# Altium schematic sheet TemperatureController.SchDoc: Fermentor Temperature Controller
size A; Engineer: James L. Haynes
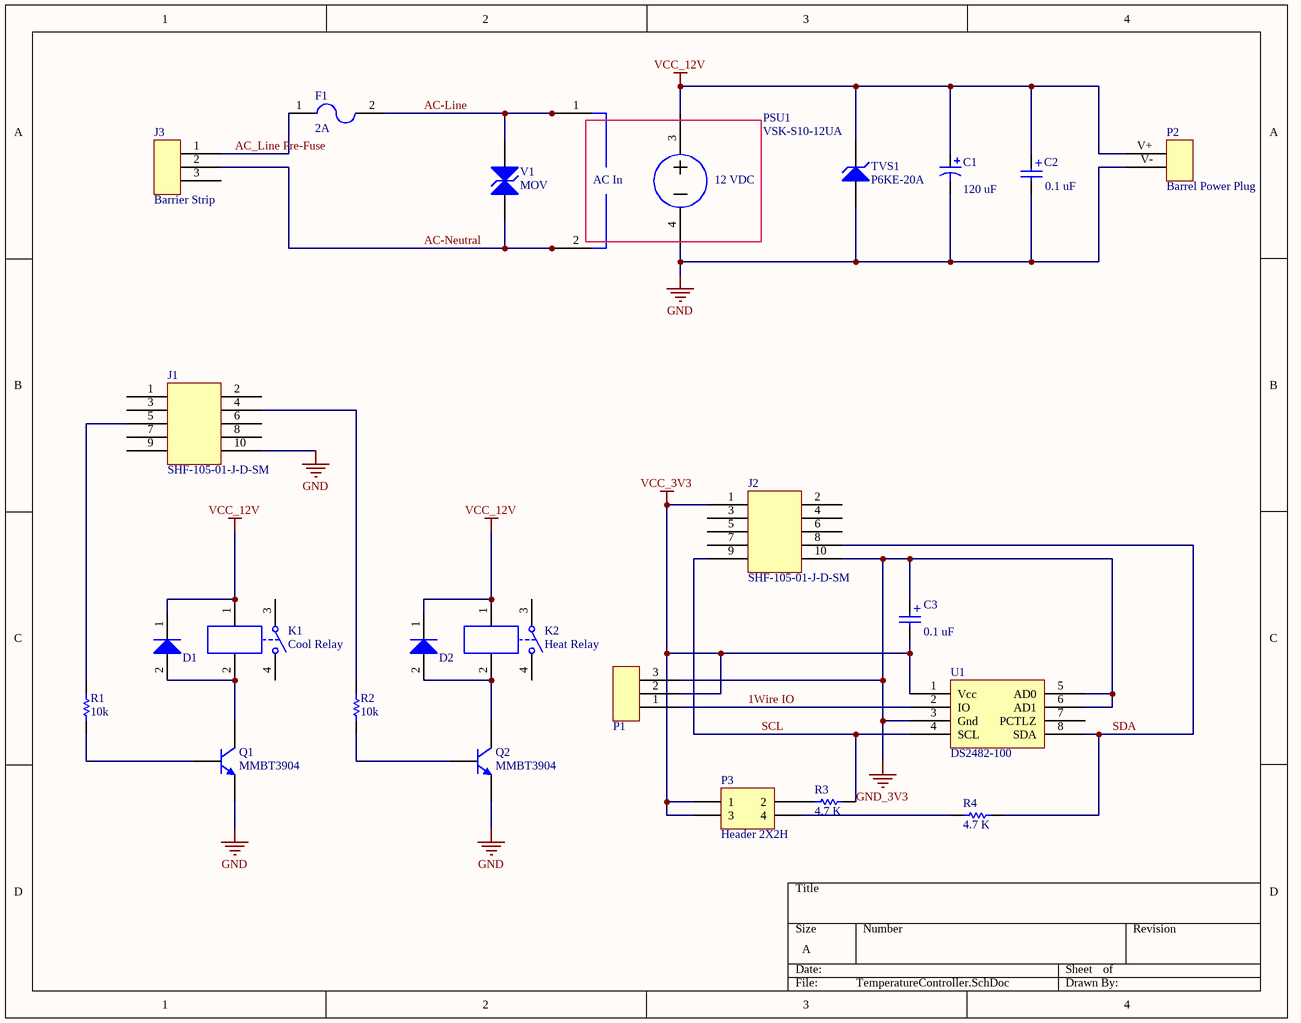
[diagram p0: TemperatureController.SchDoc]

## Parts
C1  value 120 uF  [CAPAxial680X1220_VERT]  (hidden comment: Capacitor, Polarized Axial)
C2  value 0.1 uF  [0805 [2012]]  (hidden comment: Bypass Cap)
C3  value 0.1 uF  [0805 [2012]]  (hidden comment: Bypass Cap)
D1  SMD Diode  [Diode (3mm X 1mm X 4.65mm) SMD]  (value not drawn)
D2  SMD Diode  [Diode (3mm X 1mm X 4.65mm) SMD]  (value not drawn)
F1  value 2A  [Off Board Connector]  (hidden comment: Panel Mount Fuze)
J1  SHF-105-01-J-D-SM  [Samtec SHF-105-01-J-D-SM]
J2  SHF-105-01-J-D-SM  [Samtec SHF-105-01-J-D-SM]
J3  Barrier Strip  [Molex 3 Pos Barrier Strip]
K1  Cool Relay  [Omron G5CA-1A-TP]
K2  Heat Relay  [Omron G5CA-1A-TP]
P1  1x3 Header  [1x3 Pos Header]  (value not drawn)
P2  Barrel Power Plug  [Power Plug]
P3  Header 2X2H  [HDR2X2H]
PSU1  VSK-S10-12UA  [VSK-S10-12UA]
Q1  MMBT3904  [SOT-23]
Q2  MMBT3904  [SOT-23]
R1  10k  [RES_0805]
R2  10k  [RES_0805]
R3  4.7 K  [RES_0805]
R4  4.7 K  [RES_0805]
TVS1  P6KE-20A  [DIODE Axial 400 mil]
U1  DS2482-100  [DS2482-100]
V1  MOV  [Varistor_7.62and10mm]

## Nets
GND: C1.2 C2.2 J1.10 P2.V- PSU1.4 Q1.1(E) Q2.1(E) TVS1.1(A)
GND_3V3: C3.1 J2.10 P1.3 U1.3(Gnd) U1.5(AD0) U1.6(AD1)
VCC_3V3: C3.2 J2.1 P1.2 P3.1 P3.3 U1.1(Vcc)
VCC_12V: C1.1 C2.1 D1.1 D2.1 K1.1 K2.1 P2.V+ PSU1.3 TVS1.2(K)
1Wire IO: P1.1 U1.2(IO)
AC-Line: F1.2 PSU1.1 V1.2(K)
AC-Neutral: J3.2 PSU1.2 V1.1(A)
AC_Line Pre-Fuse: F1.1 J3.1
SCL: J2.9 R3.2 U1.4(SCL)
SDA: J2.8 R4.1 U1.8(SDA)
NetD1_2: D1.2 K1.2 Q1.3(C)
NetD2_2: D2.2 K2.2 Q2.3(C)
NetJ1_4: J1.4 R2.2
NetJ1_5: J1.5 R1.2
NetP3_2: P3.2 R3.1
NetP3_4: P3.4 R4.2
NetQ1_2: Q1.2(B) R1.1
NetQ2_2: Q2.2(B) R2.1

Not connected (* = marked no-connect by the designer): J1 1 2 3 6 7 8 9; J2 2 3 4 5 6 7; J3 3; K1 3 4; K2 3 4; U1 7(PCTLZ)

## Notes on the sheet
- (in symbol Bypass Capacitor) +
- (in symbol VSK-S10-12UA) AC In; 12 VDC

## Library data of the parts
C1 = Capacitor, Polarized Axial: 120 uF Aluminum Electrolytic Capacitor (Axial); Published: 8-Jun-2000; LatestRevisionDate: 17-Jul-2002; LatestRevisionNote: Re-released for DXP Platform.; PackageReference: POLAR0.8; Publisher: Altium Limited; PackageDescription: Polarized Capacitor; 2 Leads
C2 C3 = Bypass Capacitor: 0.1 uF Capacitor SMD 0805; ComponentLink1Description: Manufacturer Link
D1 D2 = Diode: Diode, SMD, 0805
F1 = Panel Mount Fuse Holder: Panel Mount Fuze Holder; ComponentLink1Description: Manufacturer Link
J1 J2 = SHF-105-01-J-D-SM: Samtec 10 pin .050 pitch shrouded connector; ComponentLink1Description: Manufacturer Link; ComponentLink1URL: http://www.samtec.com; ComponentLink2Description: Datasheet
J3 = Molex 3 Pos Barrier Strip: ComponentLink1Description: Manufacturer Link; ComponentLink1URL: http://www.Molex.com/; ComponentLink2Description: Datasheet
K1 K2 = G5CA-1A-TP-E: Omron G5CA-1A-TP-E PCB Mount 12 V Relay with 15A contacts; ComponentLink1Description: Manufacturer Link; ComponentLink1URL: http://www.Omron.com/; ComponentLink2Description: Datasheet
P1 = 1x3 Header: Fan Connector Header, Single-row 3-position, 0.100" pitch; ComponentLink1Description: Manufacturer Link
P2 = Barrel Plug: Power Plug; ComponentLink1Description: Manufacturer Link
P3 = Header 2X2H: Header, 2-Pin, Dual row, Right Angle; LatestRevisionDate: 17-Jul-2002; LatestRevisionNote: Re-released for DXP Platform.; Publisher: Altium Limited
PSU1 = VSK-S10-12UA: AC/DC 12V Sealed PCB Mount Power Supply; ComponentLink1Description: Manufacturer Link; ComponentLink1URL: http://www.cui.com/; ComponentLink2Description: Datasheet; Value: 12V
Q1 Q2 = MMBT3904: NPN General Purpose Amplifier
R1-R4 = RES 0805
  R1 R2: Value: 10k
  R3 R4: Value: 4.7 K
TVS1 = TVS Diode: Diode, TVS, Axial; Published: 17-Dec-2003; DatasheetDocument: 29-Apr-2002; ComponentLink1Description: Manufacturer Link; ComponentLink2Description: Datasheet
U1 = DS2482: I2C to 1-Wire Bridge, SO(150mil); ComponentLink1Description: Manufacturer Link; ComponentLink2Description: Datasheet
V1 = MOV: Metal Oxide Varistor; Value: 150 V; ComponentLink1Description: Manufacturer Link; ComponentLink2Description: Datasheet